# EAGLE schematic motor_driver_ver3.0 (EAGLE 6.2)
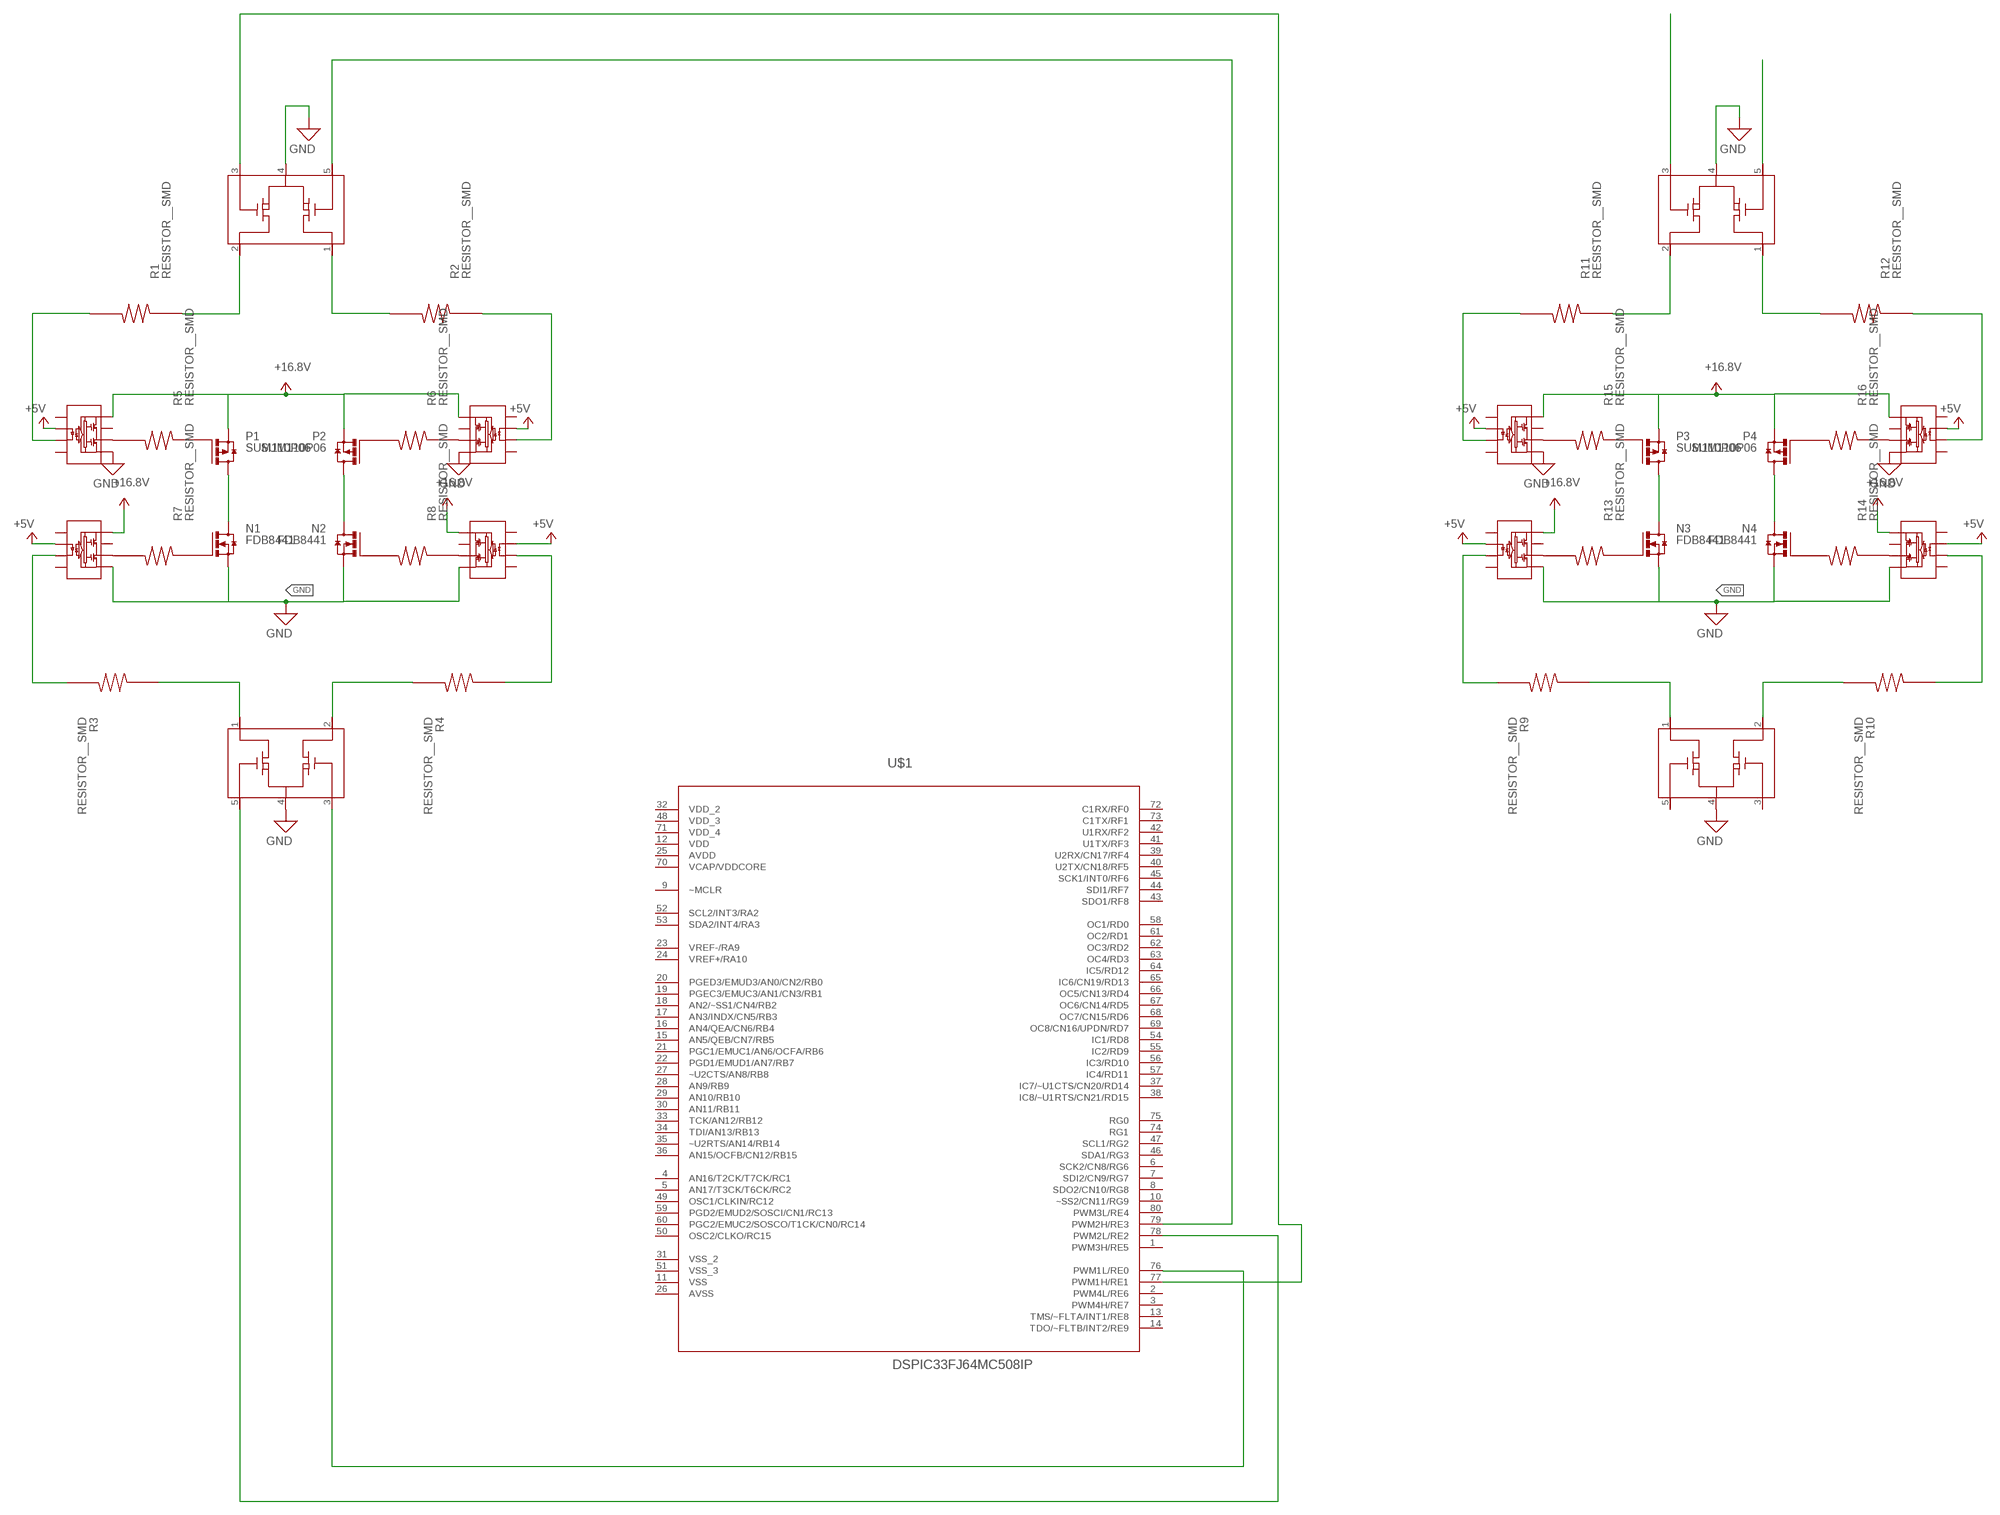
[diagram p0: schematic, sheet 1]

## Parts
F1  CPH5617  [CHP-5]
F2  CPH5617  [CHP-5]
F3  CPH5617  [CHP-5]
F4  CPH5617  [CHP-5]
IC2  TLP351  [DIL08]
IC_L_I_D  TLP351  [DIL08]
IC_L_I_U  TLP351  [DIL08]
IC_L_O_D  TLP351  [DIL08]
IC_L_O_U  TLP351  [DIL08]
N1  FDB8441  [TO-263]
N2  FDB8441  [TO-263]
N3  FDB8441  [TO-263]
N4  FDB8441  [TO-263]
P1  SUM110P06  [TO-263]
P2  SUM110P06  [TO-263]
P3  SUM110P06  [TO-263]
P4  SUM110P06  [TO-263]
R1  RESISTOR__SMD  [1608]
R2  RESISTOR__SMD  [1608]
R3  RESISTOR__SMD  [1608]
R4  RESISTOR__SMD  [1608]
R5  RESISTOR__SMD  [1608]
R6  RESISTOR__SMD  [1608]
R7  RESISTOR__SMD  [1608]
R8  RESISTOR__SMD  [1608]
R9  RESISTOR__SMD  [1608]
R10  RESISTOR__SMD  [1608]
R11  RESISTOR__SMD  [1608]
R12  RESISTOR__SMD  [1608]
R13  RESISTOR__SMD  [1608]
R14  RESISTOR__SMD  [1608]
R15  RESISTOR__SMD  [1608]
R16  RESISTOR__SMD  [1608]
U$1  DSPIC33FJ64MC508IP  [QFP50P1400X1400X120-80N]
U$18  TLP351  [DIL08]
U$20  TLP351  [DIL08]
U$21  TLP351  [DIL08]

## Nets
+5V: IC2.2(LED+) IC_L_I_D.2(LED+) IC_L_I_U.2(LED+) IC_L_O_D.2(LED+) IC_L_O_U.2(LED+) U$18.2(LED+) U$20.2(LED+) U$21.2(LED+)
+16.8V: IC2.8(VDD) IC_L_I_D.8(VDD) IC_L_I_U.8(VDD) IC_L_O_D.8(VDD) IC_L_O_U.8(VDD) P1.2(S) P2.2(S) P3.2(S) P4.2(S) U$18.8(VDD) U$20.8(VDD) U$21.8(VDD)
GND: F1.4(S) F2.4(S) F3.4(S) F4.4(S) IC2.5(GND) IC_L_I_D.5(GND) IC_L_I_U.5(GND) IC_L_O_D.5(GND) IC_L_O_U.5(GND) N1.2(S) N2.2(S) N3.2(S) N4.2(S) U$18.5(GND) U$20.5(GND) U$21.5(GND)
N$1: F2.2(D2) R4.1
N$2: F2.1(D1) R3.2
N$3: IC_L_O_D.3(LED-) R3.1
N$4: IC_L_I_D.3(LED-) R4.2
N$5: F2.3(G2) U$1.76(PWM1L/RE0)
N$6: F2.5(G1) U$1.78(PWM2L/RE2)
N$7: F1.2(D2) R1.1
N$8: F1.1(D1) R2.2
N$9: N1.1(G) R7.1
N$10: N2.1(G) R8.2
N$11: IC_L_O_D.6(OUT) R7.2
N$12: N1.3(D) P1.3(D)
N$13: N2.3(D) P2.3(D)
N$14: IC_L_I_D.6(OUT) R8.1
N$15: P1.1(G) R5.1
N$16: IC_L_O_U.6(OUT) R5.2
N$17: IC_L_O_U.3(LED-) R1.2
N$18: IC_L_I_U.3(LED-) R2.1
N$19: F1.5(G1) U$1.79(PWM2H/RE3)
N$20: F1.3(G2) U$1.77(PWM1H/RE1)
N$21: P2.1(G) R6.2
N$22: IC_L_I_U.6(OUT) R6.1
N$23: N3.3(D) P3.3(D)
N$24: N4.3(D) P4.3(D)
N$25: R9.1 U$20.3(LED-)
N$26: R10.2 U$21.3(LED-)
N$29: IC2.3(LED-) R11.2
N$30: R12.1 U$18.3(LED-)
N$31: F3.5(G1)
N$32: F3.3(G2)
N$33: F4.2(D2) R10.1
N$34: F4.1(D1) R9.2
N$35: F3.2(D2) R11.1
N$36: F3.1(D1) R12.2
N$37: N3.1(G) R13.1
N$38: R13.2 U$20.6(OUT)
N$39: N4.1(G) R14.2
N$40: R14.1 U$21.6(OUT)
N$41: P3.1(G) R15.1
N$42: IC2.6(OUT) R15.2
N$43: P4.1(G) R16.2
N$44: R16.1 U$18.6(OUT)
Unconnected: F4.3(G2) F4.5(G1) IC2.1(NC1) IC2.4(NC4) IC2.7(NC7) IC_L_I_D.1(NC1) IC_L_I_D.4(NC4) IC_L_I_D.7(NC7) IC_L_I_U.1(NC1) IC_L_I_U.4(NC4) IC_L_I_U.7(NC7) IC_L_O_D.1(NC1) IC_L_O_D.4(NC4) IC_L_O_D.7(NC7) IC_L_O_U.1(NC1) IC_L_O_U.4(NC4) IC_L_O_U.7(NC7) U$1.1(PWM3H/RE5) U$1.2(PWM4L/RE6) U$1.3(PWM4H/RE7) U$1.4(AN16/T2CK/T7CK/RC1) U$1.5(AN17/T3CK/T6CK/RC2) U$1.6(SCK2/CN8/RG6) U$1.7(SDI2/CN9/RG7) U$1.8(SDO2/CN10/RG8) U$1.9(~MCLR) U$1.10(~SS2/CN11/RG9) U$1.13(TMS/~FLTA/INT1/RE8) U$1.14(TDO/~FLTB/INT2/RE9) U$1.15(AN5/QEB/CN7/RB5) U$1.16(AN4/QEA/CN6/RB4) U$1.17(AN3/INDX/CN5/RB3) U$1.18(AN2/~SS1/CN4/RB2) U$1.19(PGEC3/EMUC3/AN1/CN3/RB1) U$1.20(PGED3/EMUD3/AN0/CN2/RB0) U$1.21(PGC1/EMUC1/AN6/OCFA/RB6) U$1.22(PGD1/EMUD1/AN7/RB7) U$1.23(VREF-/RA9) U$1.24(VREF+/RA10) U$1.27(~U2CTS/AN8/RB8) U$1.28(AN9/RB9) U$1.29(AN10/RB10) U$1.30(AN11/RB11) U$1.33(TCK/AN12/RB12) U$1.34(TDI/AN13/RB13) U$1.35(~U2RTS/AN14/RB14) U$1.36(AN15/OCFB/CN12/RB15) U$1.37(IC7/~U1CTS/CN20/RD14) U$1.38(IC8/~U1RTS/CN21/RD15) U$1.39(U2RX/CN17/RF4) U$1.40(U2TX/CN18/RF5) U$1.41(U1TX/RF3) U$1.42(U1RX/RF2) U$1.43(SDO1/RF8) U$1.44(SDI1/RF7) U$1.45(SCK1/INT0/RF6) U$1.46(SDA1/RG3) U$1.47(SCL1/RG2) U$1.49(OSC1/CLKIN/RC12) U$1.50(OSC2/CLKO/RC15) U$1.52(SCL2/INT3/RA2) U$1.53(SDA2/INT4/RA3) U$1.54(IC1/RD8) U$1.55(IC2/RD9) U$1.56(IC3/RD10) U$1.57(IC4/RD11) U$1.58(OC1/RD0) U$1.59(PGD2/EMUD2/SOSCI/CN1/RC13) U$1.60(PGC2/EMUC2/SOSCO/T1CK/CN0/RC14) U$1.61(OC2/RD1) U$1.62(OC3/RD2) U$1.63(OC4/RD3) U$1.64(IC5/RD12) U$1.65(IC6/CN19/RD13) U$1.66(OC5/CN13/RD4) U$1.67(OC6/CN14/RD5) U$1.68(OC7/CN15/RD6) U$1.69(OC8/CN16/UPDN/RD7) U$1.72(C1RX/RF0) U$1.73(C1TX/RF1) U$1.74(RG1) U$1.75(RG0) U$1.80(PWM3L/RE4) U$18.1(NC1) U$18.4(NC4) U$18.7(NC7) U$20.1(NC1) U$20.4(NC4) U$20.7(NC7) U$21.1(NC1) U$21.4(NC4) U$21.7(NC7)

## Power pins joined to a net without a drawn wire
AVDD: U$1.25(AVDD)
AVSS: U$1.26(AVSS)
VCAP/VDDCORE: U$1.70(VCAP/VDDCORE)
VDD: U$1.12(VDD)
VDD_2: U$1.32(VDD_2)
VDD_3: U$1.48(VDD_3)
VDD_4: U$1.71(VDD_4)
VSS: U$1.11(VSS)
VSS_2: U$1.31(VSS_2)
VSS_3: U$1.51(VSS_3)

## Library data of the parts
F1-F4 = 06_FET:CPH5617
IC2 IC_L_I_D IC_L_I_U IC_L_O_D IC_L_O_U U$18 U$20 U$21 = 04_IC:TLP351
N1-N4 = 06_FET:FDB8441
P1-P4 = 06_FET:SUM110P06
R1-R16 = 01_R:RESISTOR__SMD
U$1 = 07_PIC:DSPIC33FJ64MC508IP